# EAGLE design LOCO-Single Light (EAGLE 9.7.0)

## Sheet 1 of 2
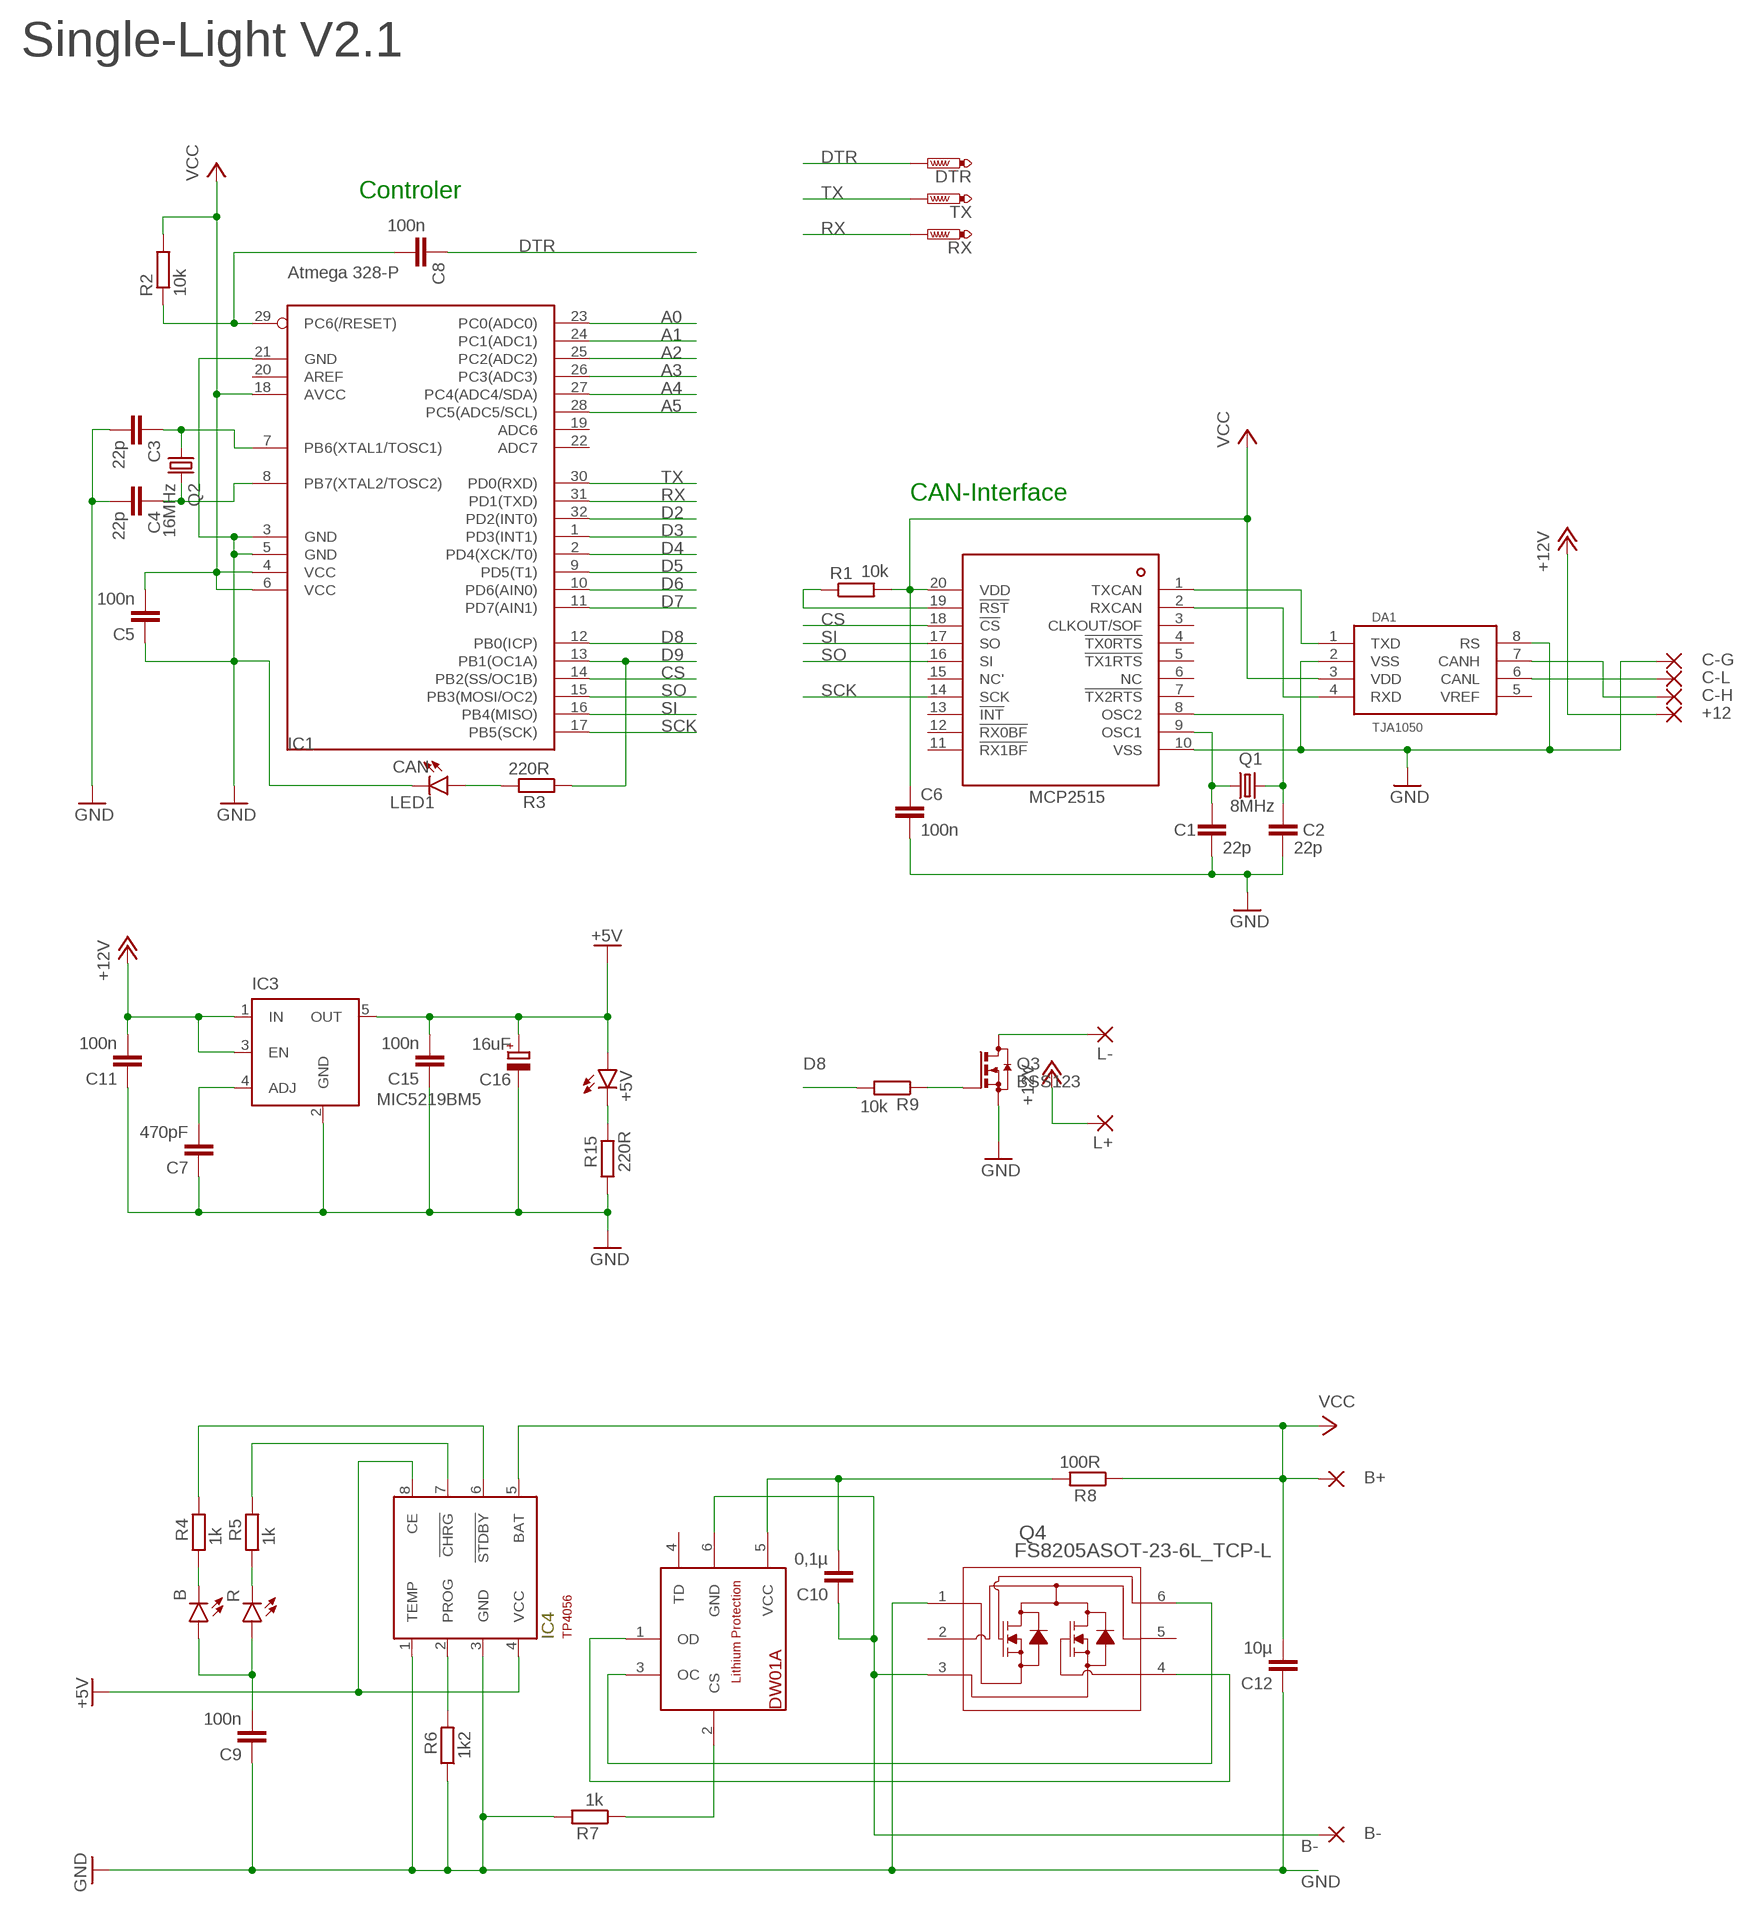
[diagram p0: schematic, sheet 1]

### Parts
+5V  LEDCHIP-LED0603  [CHIP-LED0603]
+12  1,6/0,8  [1,6/0,8]
B  LEDCHIP-LED0603  [CHIP-LED0603]
B+  1,6/0,8  [1,6/0,8]
B-  1,6/0,8  [1,6/0,8]
C1  22p  C-EUC0402K  [C0402K]
C2  22p  C-EUC0402K  [C0402K]
C3  22p  C-EUC0402K  [C0402K]
C4  22p  C-EUC0402K  [C0402K]
C5  100n  C-EUC0402K  [C0402K]
C6  100n  C-EUC0402K  [C0402K]
C7  470pF  C-EUC0402K  [C0402K]
C8  100n  C-EUC0402K  [C0402K]
C9  100n  C-EUC0402K  [C0402K]
C10  0,1µ  C-EUC0402K  [C0402K]
C11  100n  C-EUC0402K  [C0402K]
C12  10µ  C-EUC0402K  [C0402K]
C15  100n  C-EUC0402K  [C0402K]
C16  16uF  CPOL-EUA/3216-18W  [A/3216-18W]
C-G  1,6/0,8  [1,6/0,8]
C-H  1,6/0,8  [1,6/0,8]
C-L  1,6/0,8  [1,6/0,8]
CAN  LED1  LED_CHIP_BLUE-1608  [LEDC1608X39N_B]
DA1  TJA1050  [SO08]
DTR  PTR1B1,27  [B1,27]
IC1  Atmega 328-P  MEGA8-AI  [TQFP32-08]
IC2  MCP2515  [TSSOP20]
IC3  MIC5219BM5  [SOT23-5]
IC4  TP4056  [SOT23-8]
IC5  DW01A  [SOT23-6]
L+  1,6/0,8  [1,6/0,8]
L-  1,6/0,8  [1,6/0,8]
Q1  8MHz  KX-9B  [5.0X3.2_2]
Q2  16MHz  KX-9B  [5.0X3.2_2]
Q3  BSS123  [SOT23]
Q4  FS8205ASOT-23-6L_TCP-L  [SOT-23-6L_TCP-L]
R  LEDCHIP-LED0603  [CHIP-LED0603]
R1  10k  R-EU_R0402  [R0402]
R2  10k  R-EU_R0402  [R0402]
R3  220R  R-EU_R0402  [R0402]
R4  1k  R-EU_R0402  [R0402]
R5  1k  R-EU_R0402  [R0402]
R6  1k2  R-EU_R0402  [R0402]
R7  1k  R-EU_R0402  [R0402]
R8  100R  R-EU_R0402  [R0402]
R9  10k  R-EU_R0402  [R0402]
R15  220R  R-EU_R0402  [R0402]
RX  PTR1B1,27  [B1,27]
TX  PTR1B1,27  [B1,27]

### Nets
+5V: +5V.A C15.2 C16.+ IC3.5(OUT) IC4.4(VCC) IC4.8(CE)
+12V: +12.1(P) C11.2 IC3.1(IN) IC3.3(EN) L+.1(P)
A0: IC1.23(PC0(ADC0))
A1: IC1.24(PC1(ADC1))
A2: IC1.25(PC2(ADC2))
A3: IC1.26(PC3(ADC3))
A4: IC1.27(PC4(ADC4/SDA))
A5: IC1.28(PC5(ADC5/SCL))
B-: B-.1(P) C10.1 IC5.6(GND) Q4.3
CAN-H: C-H.1(P) DA1.7(CANH)
CAN-L: C-L.1(P) DA1.6(CANL)
CAN-OCC1: C1.1 IC2.9(OSC1) Q1.1
CAN-OCC2: C2.1 IC2.8(OSC2) Q1.2
CS: IC1.14(PB2(SS/OC1B)) IC2.18(!CS)
D2: IC1.32(PD2(INT0))
D3: IC1.1(PD3(INT1))
D4: IC1.2(PD4(XCK/T0))
D5: IC1.9(PD5(T1))
D6: IC1.10(PD6(AIN0))
D7: IC1.11(PD7(AIN1))
D8: IC1.12(PB0(ICP)) R9.2
D9: IC1.13(PB1(OC1A)) R3.1
DTR: C8.1 DTR.TP
GND: C1.2 C2.2 C3.2 C4.2 C5.1 C6.2 C7.1 C9.1 C11.1 C12.1 C15.1 C16.- C-G.1(P) CAN.1(C) DA1.2(VSS) DA1.8(RS) IC1.3(GND) IC1.5(GND) IC1.21(GND) IC2.10(VSS) IC3.2(GND) IC4.1(TEMP) IC4.3(GND) Q3.2(S) Q4.1 R6.1 R7.2 R15.1
LIGHT: L-.1(P) Q3.3(D)
N$1: C7.2 IC3.4(ADJ)
N$2: Q3.1(G) R9.1
N$3: CAN.2(A) R3.2
N$4: B.C R4.1
N$5: R5.1 R.C
N$6: IC2.19(!RST) R1.1
N$7: IC4.6(!STDBY) R4.2
N$8: IC4.7(!CHRG) R5.2
N$9: IC4.2(PROG) R6.2
N$10: C3.1 IC1.7(PB6(XTAL1/TOSC1)) Q2.1
N$11: C4.1 IC1.8(PB7(XTAL2/TOSC2)) Q2.2
N$12: +5V.C R15.2
N$13: B.A C9.2 R.A
N$14: IC5.3(OC) Q4.6
N$15: C8.2 IC1.29(PC6(/RESET)) R2.1
N$16: IC5.1(OD) Q4.4
N$17: C10.2 IC5.5(VCC) R8.2
N$18: IC5.2(CS) R7.1
RX: IC1.31(PD1(TXD)) RX.TP
RXCAN: DA1.4(RXD) IC2.2(RXCAN)
SCK: IC1.17(PB5(SCK)) IC2.14(SCK)
SI: IC1.16(PB4(MISO)) IC2.17(SO)
SO: IC1.15(PB3(MOSI/OC2)) IC2.16(SI)
TX: IC1.30(PD0(RXD)) TX.TP
TXCAN: DA1.1(TXD) IC2.1(TXCAN)
VCC: B+.1(P) C5.2 C6.1 C12.2 DA1.3(VDD) IC1.4(VCC) IC1.6(VCC) IC1.18(AVCC) IC2.20(VDD) IC4.5(BAT) R1.2 R2.2 R8.1
Unconnected: DA1.5(VREF) IC1.19(ADC6) IC1.20(AREF) IC1.22(ADC7) IC2.3(CLKOUT/SOF) IC2.4(!TX0RTS) IC2.5(!TX1RTS) IC2.6(NC) IC2.7(!TX2RTS) IC2.11(!RX1BF) IC2.12(!RX0BF) IC2.13(!INT) IC2.15(NC') IC5.4(TD) Q4.2 Q4.5

### Notes on the sheet
- Single-Light V2.1
- Controler
- CAN-Interface

## Sheet 2 of 2

## Library data of the parts
+5V B R = led:LED: LED OSRAM: - CHIPLED LG R971, LG N971, LY N971, LG Q971, LY Q971, LO R971, LY R971 LH N974, LH R974 LS Q976, LO Q976, LY Q976 LO Q996 - Hyper CHIPLED LW Q18S LB Q993, LB Q99A, LB R99A - SideLED LS A670, LO A670, LY A670, LG A670, LP A670 LB A673, LV A673, LT A673, LW A673 LH A674 LY A675 LS A676, LA A676, LO A676, LY A676, LW A676 LS A679, LY A679, LG A679 - Hyper Micro SIDELED® LS Y876, LA Y876, LO Y876, LY Y876 LT Y87S - SmartLED LW L88C, LW L88S LB L89C, LB L89S, LG L890 LS L89K, LO L89K, LY L89K LS L896, LA L896, LO L896, LY L896 - TOPLED LS T670, LO T670, LY T670, LG T670, LP T670 LSG T670, LSP T670, LSY T670, LOP T670, LYG T670 LG T671, LOG T671, LSG T671 LB T673, LV T673, LT T673, LW T673 LH T674 LS T676, LA T676, LO T676, LY T676, LB T676, LH T676, LSB T676, LW T676 LB T67C, LV T67C, LT T67C, LS T67K, LO T67K, LY T67K, LW E67C LS E67B, LA E67B, LO E67B, LY E67B, LB E67C, LV E67C, LT E67C LW T67C LS T679, LY T679, LG T679 LS T770, LO T770, LY T770, LG T770, LP T770 LB T773, LV T773, LT T773, LW T773 LH T774 LS E675, LA E675, LY E675, LS T675 LS T776, LA T776, LO T776, LY T776, LB T776 LHGB T686 LT T68C, LB T68C - Hyper Mini TOPLED® LB M676 - Mini TOPLED Santana® LG M470 LS M47K, LO M47K, LY M47K Source: http://www.osram.convergy.de LUXEON: - LUMILED® LXK2-PW12-R00, LXK2-PW12-S00, LXK2-PW14-U00, LXK2-PW14-V00 LXK2-PM12-R00, LXK2-PM12-S00, LXK2-PM14-U00 LXK2-PE12-Q00, LXK2-PE12-R00, LXK2-PE12-S00, LXK2-PE14-T00, LXK2-PE14-U00 LXK2-PB12-K00, LXK2-PB12-L00, LXK2-PB12-M00, LXK2-PB14-N00, LXK2-PB14-P00, LXK2-PB14-Q00 LXK2-PR12-L00, LXK2-PR12-M00, LXK2-PR14-Q00, LXK2-PR14-R00 LXK2-PD12-Q00, LXK2-PD12-R00, LXK2-PD12-S00 LXK2-PH12-R00, LXK2-PH12-S00 LXK2-PL12-P00, LXK2-PL12-Q00, LXK2-PL12-R00 Source: www.luxeon.com KINGBRIGHT: KA-3528ASYC Source: www.kingbright.com
+12 B+ B- C-G C-H C-L L+ L- = wirepad:1,6/0,8: THROUGH-HOLE PAD
C1-C12 C15 = rcl:C-EU: CAPACITOR, European symbol; SPICEPREFIX: C
C16 = rcl:CPOL-EU: POLARIZED CAPACITOR, European symbol; SPICEPREFIX: C
CAN = Opto-Electronic:LED_CHIP: LED - Generic; CATEGORY: Opto-Electronic; COLOR: Blue; SUB-CATEGORY: LED; VALUE: LED_BLUE
DA1 = TJA1050:TJA1050: High speed CAN transceiver Input levels compatible with 3.3 V and 5 V devices 5V supply
DTR RX TX = testpad:PTR1: TEST PIN
IC1 = atmel:MEGA8: MICROCONTROLLER 8 Kbytes FLASH, 1 kbytes SRAM, 512 bytes EEPROM, USART, 6-channel 10 bit ADC, 2-channel 8 bit ADC Pin compatible with Atmega48, ATMega88, ATMega168 Source: avr.lbr; MPN: ATMEGA8-16AU; OC_FARNELL: 9171371; OC_NEWARK: 73M8863
IC2 = mcp2514:MCP2515: Microchip Technology’s MCP2515 is a stand-alone Controller Area Network (CAN) controller that implements the CAN specification, version 2.0B. It is capable of transmitting and receiving both standard and extended data and remote frames. The MCP2515 has two acceptance masks and six acceptance filters that are used to filter out unwanted messages, thereby reducing the host MCUs overhead. The MCP2515 interfaces with microcontrollers (MCUs) via an industry standard Serial Peripheral Interface (SPI).
IC3 = v-reg-micrel:MIC5219BM5: VOLTAGE REGULATOR; MF: ALTERA CORPORATION; MPN: MIC5219BM5 TR; OC_FARNELL: 1100656; OC_NEWARK: 09J8939
IC4 = TP4056:TP4056: TP4056 Data sheet <http://goo.gl/J7k8TF> Dave.Calaway Eagle Library <https://goo.gl/Muy1Tr>
IC5 = DW01a:DW01A
Q1 Q2 = crystal-geyer_V1_0:KX: Quartz Crystals (MHz) SMD: KX - Serie Model Size l/w/h [mm] Frequency Range Frequency Stability Temp. Range [°C] Load Capacitance AECQ 200 availabel Datasheet KX-4 KX-5 KX-6 KX-7 KX-9A KX-9B KX-12A KX-12B KX-13 KX-20 KX-K KX-KS 1.6/1.2/0.3 2.0/1.6/0.45 2.5/2.0/0.55 3.2/2.5/0.8 5.0/3.2/1.0 5.0/3.2/1.1 6.0/3.5/1.1 6.0/3.5/1.0 7.0/5.0 /1.3 11.6/5.5/1.6 12.3/4.5/4.2 12.3/4.5/3.2 24.0 ~ 80.0 MHz 16.0 ~ 80.0 MHz 12.0 ~ 80.0 MHz 8.0 ~ 60.0 MHz 7,68 ~ 300,0 MHz 8,0 ~ 50,0 MHz 8,0 ~ 150,0 MHz 8,0 ~ 50,0 MHz 6,0 ~ 160,0 MHz 3,579 ~ 25,0 MHz 3,579 ~ 70,0 MHz 3,579 ~ 70,0 MHz ±10 … ±50ppm ±10 … ±50ppm ±10 … ±50ppm ±10 … ±50ppm ±10 … ±50ppm ±10 … ±50ppm ±10 … ±50ppm ±10 … ±50ppm ±10 … ±50ppm ±50ppm ±10 … ±50ppm ±10 … ±50ppm (*) -40°C …+85°C (*) -40°C …+125°C (*) -40°C …+125°C (*) -40°C …+125°C (*) -40°C …+105°C (*) -40°C …+105°C (*) -40°C …+125°C (*) -40°C …+105°C (*) -40°C …+105°C (*) -40°C …+105°C (*) -40°C …+85°C (*) -40°C …+85°C 8, 8…16 8, 8…16 10, 8…16 12, 7…20 16, 10…20 16, 10…20 16, 10…20 16, 12…20 16, 12…20 16, 12…20 16, 12…30 16, 12…30 - yes yes yes - - - - - - - - KX-4.pdf <http://www.geyer-electronic.de/uploads/tx_userartikelfrequenz/GEYER-KX-4.pdf> KX-5.pdf <http://www.geyer-electronic.de/uploads/tx_userartikelfrequenz/GEYER-KX-5.pdf> KX-6.pdf <http://www.geyer-electronic.de/uploads/tx_userartikelfrequenz/GEYER-KX-6.pdf> KX-7.pdf <http://www.geyer-electronic.de/uploads/tx_userartikelfrequenz/GEYER-KX-7.pdf> KX-9A.pdf <http://www.geyer-electronic.de/uploads/tx_userartikelfrequenz/GEYER-KX-9A.pdf> KX-9B.pdf <http://www.geyer-electronic.de/uploads/tx_userartikelfrequenz/GEYER-KX-9B.pdf> KX-12A.pdf <http://www.geyer-electronic.de/uploads/tx_userartikelfrequenz/GEYER-KX-12A.pdf> KX-12B.pdf <http://www.geyer-electronic.de/uploads/tx_userartikelfrequenz/GEYER-KX-12B.pdf> KX-13.pdf <http://www.geyer-electronic.de/uploads/tx_userartikelfrequenz/GEYER-KX-13.pdf> KX-20.pdf <http://www.geyer-electronic.de/uploads/tx_userartikelfrequenz/GEYER-KX-20.pdf> KX-K.pdf <http://www.geyer-electronic.de/uploads/tx_userartikelfrequenz/GEYER-KX-K.pdf> KX-KS.pdf <http://www.geyer-electronic.de/uploads/tx_userartikelfrequenz/GEYER-KX-KS.pdf> <http://www.geyer-electronic.de/fileadmin/template/img/logo-geyer-electronic.png> Details see: http://www.geyer-electronic.de/Frequenz-Produkte.9.0.html Created 2016-06-07, Hans Locher 2016 (C) Geyer Quartz Technology KX4,KX5,KX6,KX7,KX9A,KX9B,KX12A,KX12B,KX13,KX20,KXK,KXKS;1612;2016;2520;3225;5032;6035;7050;11655;12345;1,6x1,2;2,0x1,6;2,5x2,0;3,2x2,5;5,0x3,2;6,0x3,5;7,0x5,0;11,6x5,5;12,3x4,5;12,3x4,5;1.6x1.2;2.0x1.6;2.5x2.0;3.2x2.5;5.0x3.2;6.0x3.5;7.0x5.0;11.6x5.5;12.3x4.5;12.3x4.5;
Q3 = transistor-small-signal:BSS123: N-CHANNEL MOS FET
Q4 = FS8205A:FS8205A; COPYRIGHT: Copyright (C) 2023 Ultra Librarian. All rights reserved.; MANUFACTURER_PART_NUMBER: FS8205A; MFR_NAME: Tech Public
R1-R9 R15 = rcl:R-EU_: RESISTOR, European symbol; SPICEPREFIX: R

## Board
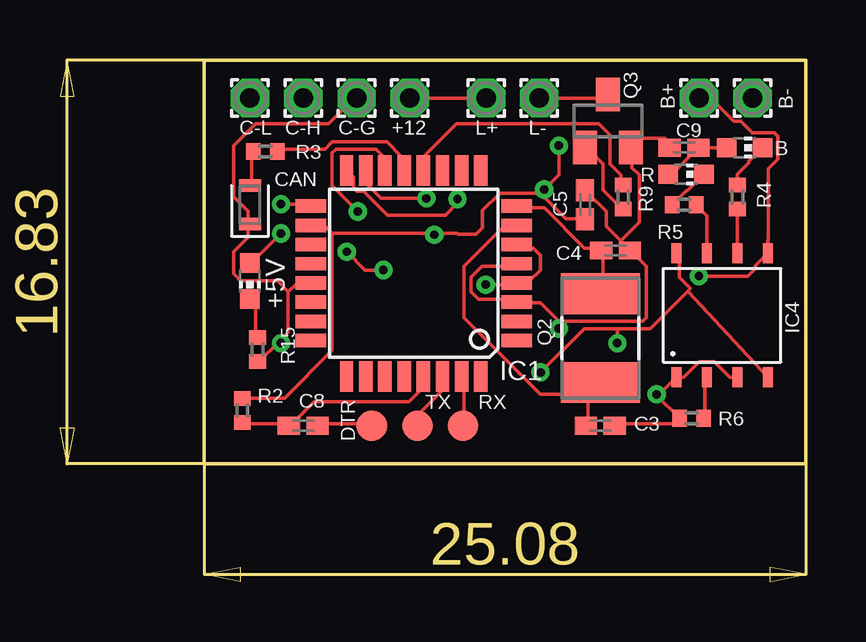
[diagram p1: board, top side]
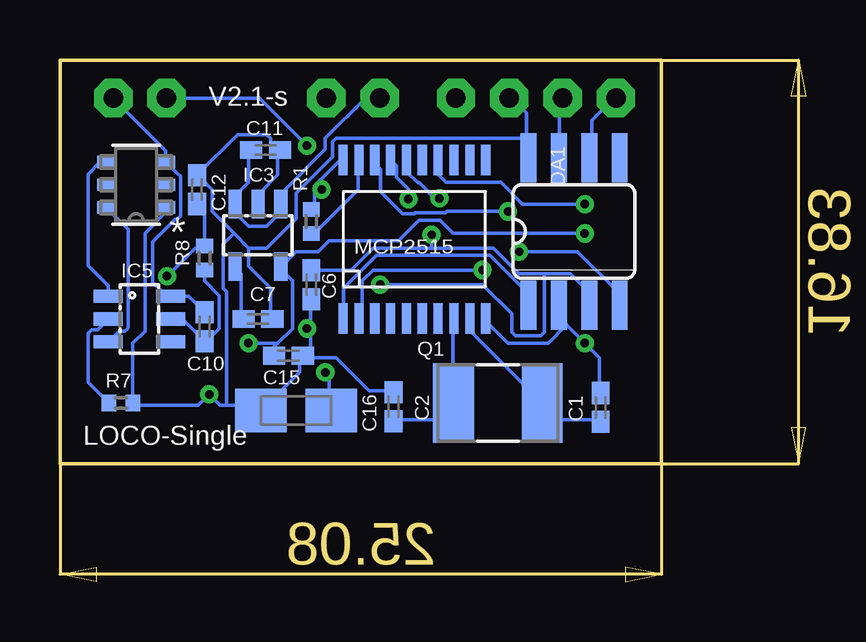
[diagram p2: board, bottom side, seen from below]

Size 25.08 x 16.83 mm. Coordinates in mm from the lower left corner, seen from the top.
Outline: 0,0 25.08,0 25.08,16.83 0,16.83 0,0
Copper layers (1*16): Top / Bottom
Stack-up Default Layer Stack: Top User Defined 0.035mm / Dielectric-1 User Defined 1.5mm / Bottom User Defined 0.035mm
Design rules "default": minimum track width 6mil, minimum drill 0.35mm, track to track 6mil, track to pad 6mil, pad to pad 6mil, via to via 6mil, smd to smd 6mil, copper to edge 40mil, drill to drill 6mil, minimum pad ring 10mil, minimum via ring 8mil, stop-mask expansion 4mil, vias tented up to drill 0mil, thermal gap 10mil

### Footprints (pad centres in the part's own frame; a part is rotated, then mirrored left to right if it is on the bottom)
CHIP-LED0603 = smd 0.8 x 0.8: A 0,-0.75; C 0,0.75
1,6/0,8 = drill 0.813 pad 1.6 octagon: 1 0,0
C0402K = smd 0.925 x 0.74: 1 -0.6,0; 2 0.6,0
A/3216-18W = smd 2.15 x 1.8: + 1.475,0; - -1.475,0
LEDC1608X39N_B = smd 0.512 x 0.912: 1 -0.8,0; 2 0.8,0
SO08 = smd 0.66 x 2.032: 1 -1.905,-3.073; 2 -0.635,-3.073; 3 0.635,-3.073; 4 1.905,-3.073; 5 1.905,3.073; 6 0.635,3.073; 7 -0.635,3.073; 8 -1.905,3.073
B1,27 = smd 1.27 x 1.27: TP 0,0
TQFP32-08 = smd 1.27 x 0.559: 1 -4.293,2.8; 2 -4.293,2; 3 -4.293,1.2; 4 -4.293,0.4; 5 -4.293,-0.4; 6 -4.293,-1.2; 7 -4.293,-2; 8 -4.293,-2.8; 17 4.293,-2.8; 18 4.293,-2; 19 4.293,-1.2; 20 4.293,-0.4; 21 4.293,0.4; 22 4.293,1.2; 23 4.293,2; 24 4.293,2.8 | smd 0.559 x 1.27: 9 -2.8,-4.293; 10 -2,-4.293; 11 -1.2,-4.293; 12 -0.4,-4.293; 13 0.4,-4.293; 14 1.2,-4.293; 15 2,-4.293; 16 2.8,-4.293; 25 2.8,4.293; 26 2,4.293; 27 1.2,4.293; 28 0.4,4.293; 29 -0.4,4.293; 30 -1.2,4.293; 31 -2,4.293; 32 -2.8,4.293
TSSOP20 = smd 1.27 x 0.381: 1 -3.302,2.642; 2 -3.302,1.981; 3 -3.302,1.321; 4 -3.302,0.66; 5 -3.302,0; 6 -3.302,-0.66; 7 -3.302,-1.321; 8 -3.302,-1.981; 9 -3.302,-2.642; 10 -3.302,-3.302; 11 3.302,-3.302; 12 3.302,-2.642; 13 3.302,-1.981; 14 3.302,-1.321; 15 3.302,-0.66; 16 3.302,0; 17 3.302,0.66; 18 3.302,1.321; 19 3.302,1.981; 20 3.302,2.642
SOT23-5 = smd 0.55 x 1.2: 1 -0.95,-1.3; 2 0,-1.3; 3 0.95,-1.3; 4 0.95,1.3; 5 -0.95,1.3
SOT23-8 = smd 0.42 x 0.835: 1 -1.905,-2.58; 2 -0.635,-2.58; 3 0.635,-2.58; 4 1.905,-2.58; 5 1.905,2.58; 6 0.635,2.58; 7 -0.635,2.58; 8 -1.905,2.58
SOT23-6 = smd 0.55 x 1.2: 1 -0.95,-1.3; 2 0,-1.3; 3 0.95,-1.3; 4 0.95,1.3; 5 0,1.3; 6 -0.95,1.3
5.0X3.2_2 = smd 1.7 x 3.3: 1 -1.85,0; 2 1.85,0
SOT23 = smd 1 x 1.4: 1 -0.95,-1.1; 2 0.95,-1.1; 3 0,1.1
SOT-23-6L_TCP-L = smd 0.775 x 0.508: 1 -1.238,0.95; 2 -1.238,0; 3 -1.238,-0.95; 4 1.238,-0.95; 5 1.238,0; 6 1.238,0.95
R0402 = smd 0.6 x 0.7: 1 -0.5,0; 2 0.5,0

### Placement (x,y rotation side)
+5V  1.91,7.62 180 top
+12  8.57,15.24 0 top
B  22.52,13.18 270 top
B+  20.64,15.24 0 top
B-  22.86,15.24 0 top
C1  2.54,2.35 90 bottom
C2  11.18,2.38 90 bottom
C3  16.51,1.59 0 top
C4  17.14,8.89 0 top
C5  15.88,10.79 270 top
C6  14.61,7.46 270 bottom
C7  16.83,6.03 180 bottom
C8  4.13,1.59 180 top
C9  20,13.18 0 top
C10  19.05,5.71 270 bottom
C11  16.51,13.08 180 bottom
C12  19.37,11.43 270 bottom
C15  15.56,4.51 180 bottom
C16  15.24,2.22 0 bottom
C-G  6.35,15.24 0 top
C-H  4.13,15.24 0 top
C-L  1.91,15.24 0 top
CAN  1.91,10.79 90 top
DA1  3.65,9.68 0 bottom
DTR  6.99,1.59 0 top
IC1  8.73,7.94 180 top
IC2  10.64,9.37 90 bottom
IC3  16.83,9.53 180 bottom
IC4  21.59,6.19 0 top
IC5  21.77,6.03 270 bottom
L+  11.75,15.24 0 top
L-  13.97,15.24 0 top
Q1  6.83,2.54 180 bottom
Q2  16.51,5.24 90 top
Q3  16.83,14.29 0 top
Q4  21.91,11.63 180 bottom
R  20.09,12.06 270 top
R1  14.61,10.1 90 bottom
R2  1.59,2.22 90 top
R3  2.54,13.02 180 top
R4  22.23,11.11 270 top
R5  20,10.79 0 top
R6  20.32,1.91 0 top
R7  22.54,2.54 0 bottom
R8  19.05,8.57 270 bottom
R9  17.46,11.11 90 top
R15  2.22,4.76 90 top
RX  10.79,1.59 0 top
TX  8.89,1.59 0 top

### Tracks (layer width: path | path; a pad name or v marks a point on that pad's centre or on a via)
+5V  (via drill 0.35)
  Top 0.152: 20.16,7.2 IC4.4 | v14.02,3.81 15.85,5.64 17.22,5.64 | 17.22,5.64 18.59,5.64 20.16,7.2 | 20.16,7.2 20.27,7.32 19.8,7.78 19.8,8.65 IC4.8 | v3.2,9.6 1.98,8.38 +5V.A | v17.22,5.03 17.22,5.64
  Bottom 0.152: v14.02,3.81 13.87,3.66 13.87,2.29 C16.+ | v3.2,9.6 8.69,9.6 9.24,10.15 10.12,10.15 10.97,9.3 13.87,9.3 14.33,8.84 15.24,8.84 15.85,8.23 IC3.5 15.85,8.08 15.39,7.62 15.39,5.64 16,5.03 | 16,5.03 16.15,4.88 16.15,4.57 C15.2 | 16,5.03 v17.22,5.03
+12V
  Top 0.152: L+.1 +12.1
  Bottom 0.152: C11.2 17.22,12.95 17.22,11.73 17.68,11.28 17.68,10.97 IC3.3 17.68,10.82 17.68,10.36 17.22,9.91 16.46,9.91 16,10.36 16,10.82 IC3.1 15.85,10.97 15.85,11.28 14.02,13.11 14.02,13.56 12.34,15.24 L+.1
B-
  Bottom 0.152: C10.1 19.72,6.98 IC5.6 20.64,6.98 21.23,7.57 21.23,9.25 20.28,10.2 20.19,10.2 20.05,10.33 20.05,11.98 20.19,12.11 20.2,12.11 Q4.3 20.67,13.05 B-.1
CAN-H
  Bottom 0.152: DA1.7 4.27,12.8 4.27,15.24 C-H.1
CAN-L
  Bottom 0.152: DA1.6 2.9,12.8 2.9,14.33 1.98,15.24 C-L.1
CAN-OCC1
  Bottom 0.152: C1.1 2.59,1.83 4.27,1.83 4.88,2.44 Q1.1 5.03,2.59 7.92,5.49 7.92,5.94 IC2.9
CAN-OCC2
  Bottom 0.152: C2.1 11.12,1.83 9.3,1.83 8.69,2.44 Q1.2 8.69,2.59 8.69,5.94 IC2.8
CS  (via drill 0.35)
  Top 0.152: v6.4,10.52 5.33,11.58 5.33,12.95 5.49,13.11 7.16,13.11 7.47,12.8 7.47,12.34 IC1.14
  Bottom 0.152: v6.4,10.52 8.96,10.52 9.01,10.46 10.27,10.46 10.31,10.43 10.81,10.43 11.72,11.33 11.72,12.27 11.96,12.51 IC2.18
D8
  Top 0.152: R9.2 17.37,11.73 17.37,12.04 16.92,12.5 16.92,13.72 16.46,14.17 10.52,14.17 9.14,12.8 9.14,12.34 IC1.12
D9
  Top 0.152: R3.1 3.05,13.11 5.03,13.11 5.33,13.41 7.62,13.41 8.23,12.8 8.23,12.34 IC1.13
DTR
  Top 0.152: C8.1 4.88,1.68 6.86,1.68 DTR.TP
GND  (via drill 0.35)
  Top 0.152: 3.05,5.03 3.5,5.49 3.5,7.16 | 3.05,5.03 2.29,4.27 R15.1 | 3.5,7.16 3.81,7.47 4.42,7.47 IC1.21 | 3.5,7.16 3.05,7.62 1.52,7.62 1.22,7.92 1.22,8.84 1.83,9.45 1.83,9.91 CAN.1 1.83,10.06 1.83,10.52 1.22,11.12 1.22,13.26 2.13,14.17 5.18,14.17 6.25,15.24 C-G.1 | 3.05,5.03 v3.2,5.03 | IC1.5 12.95,8.23 11.58,8.23 11.12,7.77 11.12,7.16 11.43,6.86 12.95,6.86 IC1.3 13.11,6.71 14.02,6.71 14.78,5.94 | C9.1 19.2,13.56 18.14,13.56 17.83,13.26 Q3.2 17.83,13.11 17.83,12.34 18.14,12.04 18.14,10.06 17.37,9.3 | 17.37,9.3 17.68,8.99 C4.2 17.83,8.84 18.44,8.23 18.44,6.1 18.29,5.94 14.78,5.94 | 17.37,9.3 16.76,9.91 16.76,10.52 16,11.28 C5.1 | C3.2 17.22,1.68 19.66,1.68 19.81,1.83 R6.1 18.86,2.87 v18.86,2.9 18.97,2.9 IC4.1 20,3.61 20.65,4.26 21.26,4.26 21.91,3.61 IC4.3 | v14.78,5.64 14.78,5.94
  Bottom 0.152: 3.96,5.79 4.27,6.1 4.27,6.55 DA1.2 3.96,5.79 | 3.96,5.79 v3.2,5.03 2.59,4.42 2.59,3.05 C1.2 | 3.96,5.79 4.72,5.03 6.4,5.03 7.32,5.94 IC2.10 | 5.64,13.56 5.64,14.63 6.25,15.24 C-G.1 | 5.64,13.56 5.64,12.8 DA1.8 5.64,13.56 | IC3.2 16.76,10.97 16.76,11.28 16,12.04 16,12.95 C11.1 16,13.11 16.31,13.41 16.31,13.56 16.46,13.72 17.68,13.72 19.36,12.04 | 17.22,8.99 17.22,8.23 16.31,7.32 16.31,6.1 C7.1 | 17.83,9.6 18.75,10.52 18.75,11.43 19.36,12.04 | 17.83,9.6 17.22,8.99 | 19.36,12.04 C12.1 | 14.63,4.42 14.94,4.42 C15.1 | 14.63,4.42 13.56,4.42 12.19,3.05 11.28,3.05 C2.2 | 14.63,4.42 14.63,5.64 | 14.63,5.64 14.63,6.86 C6.2 | 14.63,4.42 C15.1 | 18.14,2.44 16.92,2.44 16.76,2.29 C16.- 16.61,2.29 15.09,3.81 15.09,4.42 C15.1 | 18.14,2.44 18.4,2.44 v18.86,2.9 19.32,2.44 21.95,2.44 R7.2 22.04,5.02 21.53,5.53 21.53,9.62 20.67,10.48 Q4.1 | 17.83,9.6 18.29,9.14 18.29,7.32 18.14,7.16 18.14,2.44 | 14.63,5.64 v14.78,5.64 | 5.64,13.56 13.56,13.56 13.72,13.41 13.72,12.8 15.24,11.28 15.24,10.21 16.46,8.99 17.22,8.99
LIGHT
  Top 0.152: L-.1 16.76,15.24 Q3.3
N$1
  Bottom 0.152: C7.2 17.53,6.1 17.53,7.92 17.68,8.08 IC3.4
N$2
  Top 0.152: R9.1 17.37,10.67 16.61,11.43 16.61,12.5 16,13.11 Q3.1
N$3
  Top 0.152: R3.2 1.98,12.95 1.98,11.73 CAN.2
N$4
  Top 0.152: B.C 22.71,12.61 22.71,12.55 22.23,12.07 R4.1
N$5
  Top 0.152: R.C 20.15,11.37 20.11,11.37 19.53,10.79 R5.1
N$6
  Bottom 0.152: R1.1 14.48,9.6 12.65,11.43 12.65,12.65 IC2.19
N$7
  Top 0.152: R4.2 IC4.6
N$8
  Top 0.152: IC4.7 20.95,10.34 R5.2
N$9
  Top 0.152: R6.2 20.88,1.98 20.88,3.49 IC4.2
N$10
  Top 0.152: 16,2.9 16,1.68 C3.1 | 16,2.9 16.46,3.35 Q2.1 16,2.9 | 16,2.9 14.02,2.9 10.82,6.1 10.82,8.23 12.5,9.91 12.95,9.91 IC1.7
N$11
  Top 0.152: Q2.2 16.61,7.16 16.61,8.84 C4.1 16.46,8.99 15.85,8.99 14.17,10.67 13.11,10.67 IC1.8
N$12
  Top 0.152: R15.2 2.13,5.33 2.13,6.71 1.98,6.86 +5V.C
N$13
  Top 0.152: B.A C9.2 19.49,12.06 R.A
N$14
  Bottom 0.152: IC5.3 22.62,5.53 22.38,5.53 22.29,5.62 22.24,5.66 22.24,9.78 Q4.6
N$15
  Top 0.152: R2.1 1.68,1.68 3.5,1.68 C8.2 3.66,1.68 4.57,2.59 8.53,2.59 8.99,3.05 8.99,3.5 IC1.29
N$16
  Bottom 0.152: IC5.1 23.07,7.42 23.91,8.26 23.91,12.06 23.4,12.58 Q4.4
N$17
  Bottom 0.152: R8.2 19.05,7.62 18.44,7.01 18.44,5.64 19.05,5.03 C10.2 19.97,6.03 IC5.5
N$18
  Bottom 0.152: IC5.2 23.52,5.59 23.77,5.59 23.9,5.45 23.9,3.4 R7.1
RX
  Top 0.152: IC1.31 10.82,3.5 10.82,1.68 RX.TP
RXCAN  (via drill 0.35)
  Top 0.152: v7.47,8.08 6.71,8.08 v5.94,8.84
  Bottom 0.152: v7.47,8.08 12.04,8.08 12.5,7.62 12.5,6.1 IC2.2 | v5.94,8.84 3.5,8.84 1.83,7.16 1.83,6.71 DA1.4
SCK  (via drill 0.35)
  Top 0.152: v3.2,10.82 4.42,10.82 IC1.17
  Bottom 0.152: v3.2,10.82 5.79,10.82 6.71,11.73 8.99,11.73 9.3,12.04 9.3,12.65 IC2.14
SI  (via drill 0.35)
  Top 0.152: IC1.16 6.22,11.94 6.22,11.5 6.36,11.37 6.64,11.37 7.64,10.37 10.05,10.37 10.56,10.87 v10.56,11.03
  Bottom 0.152: IC2.17 11.05,12.43 11.05,11.94 10.56,11.44 v10.56,11.03
SO  (via drill 0.35)
  Top 0.152: IC1.15 6.86,12.19 6.86,11.58 7.38,11.06 v9.26,11.06
  Bottom 0.152: v9.26,11.06 9.46,11.06 10.1,11.71 10.16,11.71 10.64,12.18 IC2.16
TX
  Top 0.152: TX.TP 8.99,1.68 8.99,2.13 9.91,3.05 9.91,3.5 IC1.30
TXCAN
  Bottom 0.152: IC2.1 13.26,6.1 13.26,7.32 11.89,8.69 7.16,8.69 5.64,7.16 5.64,6.71 DA1.1
VCC  (via drill 0.35)
  Top 0.152: IC1.6 13.11,8.99 13.72,8.99 14.02,8.69 14.02,8.08 13.56,7.62 13.11,7.62 IC1.4 12.95,7.47 v11.73,7.47 | 5.33,9.6 5.33,4.72 3.35,2.74 1.68,2.74 R2.2 | 5.33,9.6 5.03,9.91 4.57,9.91 IC1.18 | 14.02,11.28 15.09,10.21 15.85,10.21 C5.2 | 5.33,9.6 9.6,9.6 | 14.02,11.28 v14.17,11.43 14.78,12.04 v14.78,13.26 | v20.62,7.82 21.79,7.82 22.66,7.82 22.97,8.13 22.97,8.24 IC4.5 23.5,9.31 23.51,9.33 23.51,12.29 23.91,12.69 23.91,13.66 23.77,13.8 22.84,13.8 22.38,14.27 22.09,14.27 21.11,15.24 B+.1 | 14.02,11.28 12.33,11.28 11.61,10.56 11.61,9.84 11.33,9.57 10.58,9.57 10.54,9.6 9.6,9.6 | 9.6,9.6 9.59,9.59 v9.59,9.55
  Bottom 0.152: 9.6,8.99 7.01,8.99 5.94,7.92 4.88,7.92 | 9.6,8.99 12.04,8.99 12.95,8.08 14.48,8.08 C6.1 | 4.88,7.92 3.81,7.92 3.05,7.16 3.05,6.71 DA1.3 | v11.73,7.47 7.47,7.47 6.25,6.25 6.25,5.49 6.1,5.33 5.03,5.33 4.88,5.49 4.88,7.92 | C12.2 19.36,10.82 19.05,10.52 R8.1 19.05,8.99 19.45,8.99 v20.62,7.82 | 14.48,11.43 14.48,11.58 13.41,12.65 IC2.20 | 14.48,11.43 14.48,10.67 R1.2 | v14.17,11.43 14.48,11.43 | B+.1 16.76,15.24 v14.78,13.26 | 9.6,8.99 9.6,9.53 v9.59,9.55

### Text on the board
bNames: V2.1-s | LOCO-Single